# Altium schematic sheet DRS4_ADC.SchDoc: My title
size A3; Organization: University of California; Address1: 475 Portola Plaza; Address2: Los Angeles, CA 90095; DocumentNumber: 22; Revision: R01; SheetNumber: 22; SheetTotal: 35
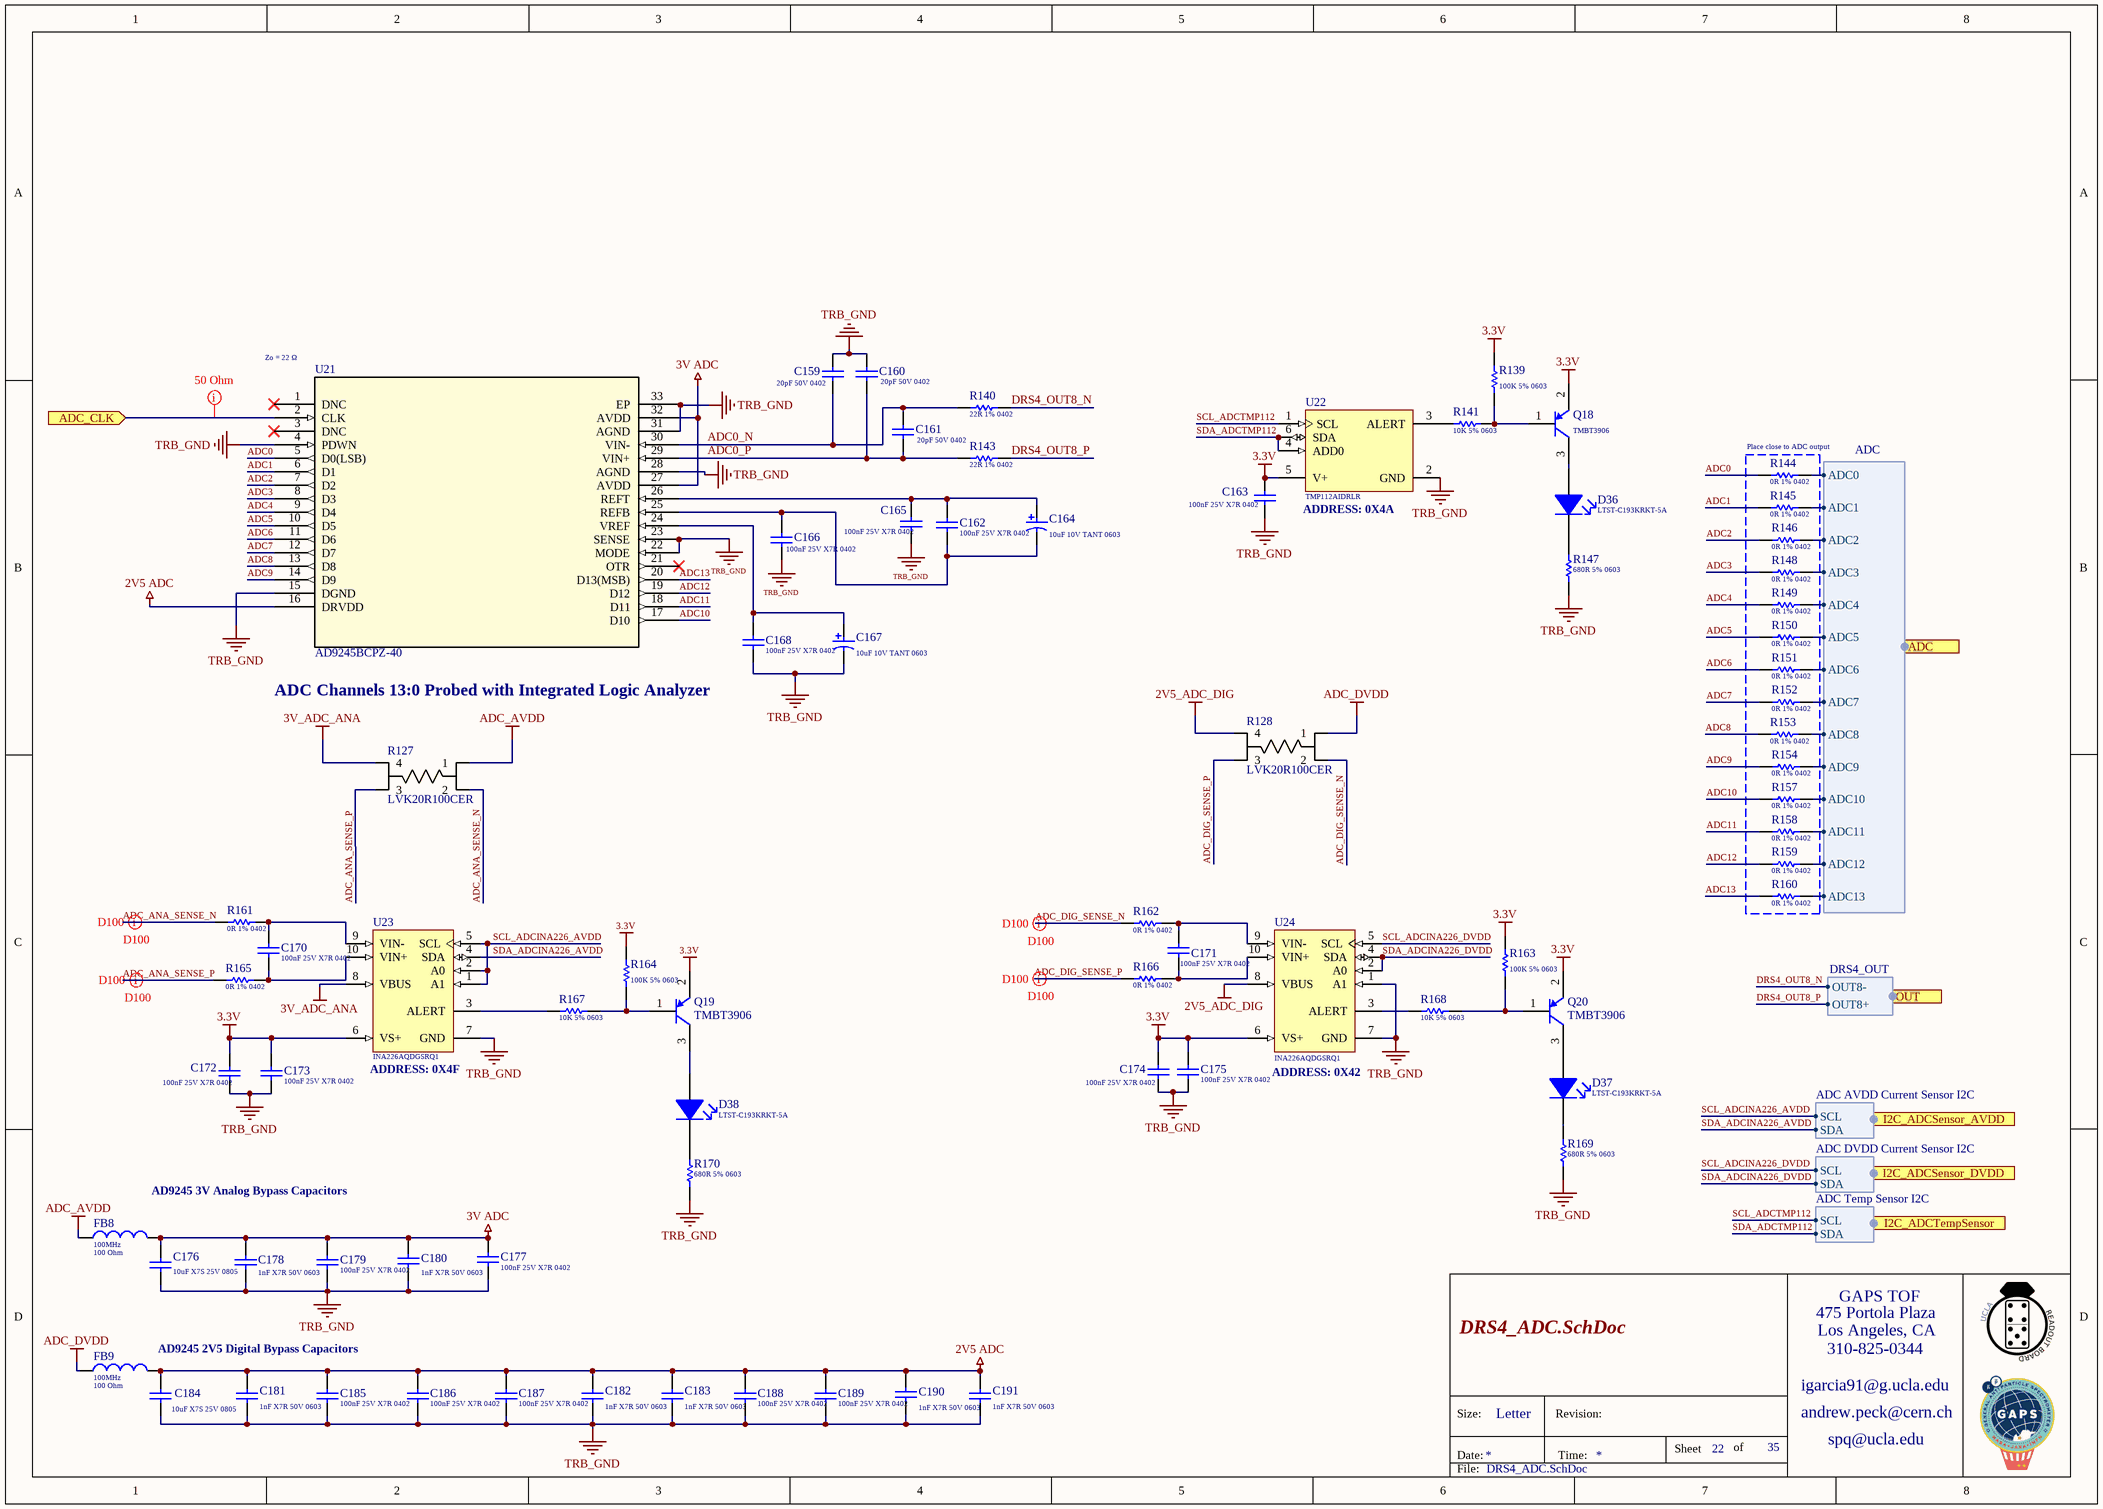
[diagram p0: DRS4_ADC.SchDoc]

## Parts
C159  Capacitance: 20pF 50V 0402  [Cap_Murata_GJM1555C1H200GB01D_20pF]  (hidden comment: Cap_Murata_GJM1555C1H200GB01D_20pF)
C160  Capacitance: 20pF 50V 0402  [Cap_Murata_GJM1555C1H200GB01D_20pF]  (hidden comment: Cap_Murata_GJM1555C1H200GB01D_20pF)
C161  Capacitance: 20pF 50V 0402  [Cap_Murata_GJM1555C1H200GB01D_20pF]  (hidden comment: Cap_Murata_GJM1555C1H200GB01D_20pF)
C162  Capacitance: 100nF 25V X7R 0402  [Cap_Taiyo_Yuden_TMK105B7104KV-FR_100nF]  (hidden comment: Cap_Taiyo_Yuden_TMK105B7104KV-FR_100nF)
C163  Capacitance: 100nF 25V X7R 0402  [Cap_Taiyo_Yuden_TMK105B7104KV-FR_100nF]  (hidden comment: Cap_Taiyo_Yuden_TMK105B7104KV-FR_100nF)
C164  10uF 10V TANT 0603  [VISH-TR8-M_L]
C165  Capacitance: 100nF 25V X7R 0402  [Cap_Taiyo_Yuden_TMK105B7104KV-FR_100nF]  (hidden comment: Cap_Taiyo_Yuden_TMK105B7104KV-FR_100nF)
C166  Capacitance: 100nF 25V X7R 0402  [Cap_Taiyo_Yuden_TMK105B7104KV-FR_100nF]  (hidden comment: Cap_Taiyo_Yuden_TMK105B7104KV-FR_100nF)
C167  10uF 10V TANT 0603  [VISH-TR8-M_L]
C168  Capacitance: 100nF 25V X7R 0402  [Cap_Taiyo_Yuden_TMK105B7104KV-FR_100nF]  (hidden comment: Cap_Taiyo_Yuden_TMK105B7104KV-FR_100nF)
C170  Capacitance: 100nF 25V X7R 0402  [Cap_Taiyo_Yuden_TMK105B7104KV-FR_100nF]  (hidden comment: Cap_Taiyo_Yuden_TMK105B7104KV-FR_100nF)
C171  Capacitance: 100nF 25V X7R 0402  [Cap_Taiyo_Yuden_TMK105B7104KV-FR_100nF]  (hidden comment: Cap_Taiyo_Yuden_TMK105B7104KV-FR_100nF)
C172  Capacitance: 100nF 25V X7R 0402  [Cap_Taiyo_Yuden_TMK105B7104KV-FR_100nF]  (hidden comment: Cap_Taiyo_Yuden_TMK105B7104KV-FR_100nF)
C173  Capacitance: 100nF 25V X7R 0402  [Cap_Taiyo_Yuden_TMK105B7104KV-FR_100nF]  (hidden comment: Cap_Taiyo_Yuden_TMK105B7104KV-FR_100nF)
C174  Capacitance: 100nF 25V X7R 0402  [Cap_Taiyo_Yuden_TMK105B7104KV-FR_100nF]  (hidden comment: Cap_Taiyo_Yuden_TMK105B7104KV-FR_100nF)
C175  Capacitance: 100nF 25V X7R 0402  [Cap_Taiyo_Yuden_TMK105B7104KV-FR_100nF]  (hidden comment: Cap_Taiyo_Yuden_TMK105B7104KV-FR_100nF)
C176  Capacitance: 10uF X7S 25V 0805  [Cap_Murata_ GRM21BC71E106ME11L_10uF]  (hidden comment: Cap_Murata_ GRM21BC71E106ME11L_10uF)
C177  Capacitance: 100nF 25V X7R 0402  [Cap_Taiyo_Yuden_TMK105B7104KV-FR_100nF]  (hidden comment: Cap_Taiyo_Yuden_TMK105B7104KV-FR_100nF)
C178  Capacitance: 1nF X7R 50V 0603  [Cap_Kemet_C0603C102J5RACAUTO_1nF]  (hidden comment: Cap_Kemet_C0603C102J5RACAUTO_1nF)
C179  Capacitance: 100nF 25V X7R 0402  [Cap_Taiyo_Yuden_TMK105B7104KV-FR_100nF]  (hidden comment: Cap_Taiyo_Yuden_TMK105B7104KV-FR_100nF)
C180  Capacitance: 1nF X7R 50V 0603  [Cap_Kemet_C0603C102J5RACAUTO_1nF]  (hidden comment: Cap_Kemet_C0603C102J5RACAUTO_1nF)
C181  Capacitance: 1nF X7R 50V 0603  [Cap_Kemet_C0603C102J5RACAUTO_1nF]  (hidden comment: Cap_Kemet_C0603C102J5RACAUTO_1nF)
C182  Capacitance: 1nF X7R 50V 0603  [Cap_Kemet_C0603C102J5RACAUTO_1nF]  (hidden comment: Cap_Kemet_C0603C102J5RACAUTO_1nF)
C183  Capacitance: 1nF X7R 50V 0603  [Cap_Kemet_C0603C102J5RACAUTO_1nF]  (hidden comment: Cap_Kemet_C0603C102J5RACAUTO_1nF)
C184  Capacitance: 10uF X7S 25V 0805  [Cap_Murata_ GRM21BC71E106ME11L_10uF]  (hidden comment: Cap_Murata_ GRM21BC71E106ME11L_10uF)
C185  Capacitance: 100nF 25V X7R 0402  [Cap_Taiyo_Yuden_TMK105B7104KV-FR_100nF]  (hidden comment: Cap_Taiyo_Yuden_TMK105B7104KV-FR_100nF)
C186  Capacitance: 100nF 25V X7R 0402  [Cap_Taiyo_Yuden_TMK105B7104KV-FR_100nF]  (hidden comment: Cap_Taiyo_Yuden_TMK105B7104KV-FR_100nF)
C187  Capacitance: 100nF 25V X7R 0402  [Cap_Taiyo_Yuden_TMK105B7104KV-FR_100nF]  (hidden comment: Cap_Taiyo_Yuden_TMK105B7104KV-FR_100nF)
C188  Capacitance: 100nF 25V X7R 0402  [Cap_Taiyo_Yuden_TMK105B7104KV-FR_100nF]  (hidden comment: Cap_Taiyo_Yuden_TMK105B7104KV-FR_100nF)
C189  Capacitance: 100nF 25V X7R 0402  [Cap_Taiyo_Yuden_TMK105B7104KV-FR_100nF]  (hidden comment: Cap_Taiyo_Yuden_TMK105B7104KV-FR_100nF)
C190  Capacitance: 1nF X7R 50V 0603  [Cap_Kemet_C0603C102J5RACAUTO_1nF]  (hidden comment: Cap_Kemet_C0603C102J5RACAUTO_1nF)
C191  Capacitance: 1nF X7R 50V 0603  [Cap_Kemet_C0603C102J5RACAUTO_1nF]  (hidden comment: Cap_Kemet_C0603C102J5RACAUTO_1nF)
D36  LTST-C193KRKT-5A  [Led_Lite-On_LTST-C193KGKT-5A_Red]
D37  LTST-C193KRKT-5A  [Led_Lite-On_LTST-C193KGKT-5A_Red]
D38  LTST-C193KRKT-5A  [Led_Lite-On_LTST-C193KGKT-5A_Red]
FB8  Measuring Frequency: 100MHz  Impedance: 100 Ohm  [FB_Wurth_Electronics_742792731_100Ohms]  (hidden comment: 742792731)
FB9  Measuring Frequency: 100MHz  Impedance: 100 Ohm  [FB_Wurth_Electronics_742792731_100Ohms]  (hidden comment: 742792731)
Q18  Series: TMBT3906  [BJT_PNP_Toshiba_TMBT3906]  (hidden comment: BJT_PNP_Toshiba_TMBT3906)
Q19  Series: TMBT3906  [BJT_PNP_Toshiba_TMBT3906]  (hidden comment: BJT_PNP_Toshiba_TMBT3906)
Q20  Series: TMBT3906  [BJT_PNP_Toshiba_TMBT3906]  (hidden comment: BJT_PNP_Toshiba_TMBT3906)
R127  LVK20R100CER  [OH_LVK20_OHM]
R128  LVK20R100CER  [OH_LVK20_OHM]
R139  100K 5% 0603  [RESC0603(1608)_N]
R140  22R 1% 0402  [RESC0402(1005)_L]
R141  10K 5% 0603  [RESC0603(1608)_L]
R143  22R 1% 0402  [RESC0402(1005)_L]
R144  Resistance: 0R 1% 0402  [Res_Vishay_CRCW04020000Z0EDC_0_Ohm]  (hidden comment: Res_Vishay_CRCW04020000Z0EDC_0_Ohm)
R145  Resistance: 0R 1% 0402  [Res_Vishay_CRCW04020000Z0EDC_0_Ohm]  (hidden comment: Res_Vishay_CRCW04020000Z0EDC_0_Ohm)
R146  Resistance: 0R 1% 0402  [Res_Vishay_CRCW04020000Z0EDC_0_Ohm]  (hidden comment: Res_Vishay_CRCW04020000Z0EDC_0_Ohm)
R147  680R 5% 0603  [RESC0603(1608)_L]
R148  Resistance: 0R 1% 0402  [Res_Vishay_CRCW04020000Z0EDC_0_Ohm]  (hidden comment: Res_Vishay_CRCW04020000Z0EDC_0_Ohm)
R149  Resistance: 0R 1% 0402  [Res_Vishay_CRCW04020000Z0EDC_0_Ohm]  (hidden comment: Res_Vishay_CRCW04020000Z0EDC_0_Ohm)
R150  Resistance: 0R 1% 0402  [Res_Vishay_CRCW04020000Z0EDC_0_Ohm]  (hidden comment: Res_Vishay_CRCW04020000Z0EDC_0_Ohm)
R151  Resistance: 0R 1% 0402  [Res_Vishay_CRCW04020000Z0EDC_0_Ohm]  (hidden comment: Res_Vishay_CRCW04020000Z0EDC_0_Ohm)
R152  Resistance: 0R 1% 0402  [Res_Vishay_CRCW04020000Z0EDC_0_Ohm]  (hidden comment: Res_Vishay_CRCW04020000Z0EDC_0_Ohm)
R153  Resistance: 0R 1% 0402  [Res_Vishay_CRCW04020000Z0EDC_0_Ohm]  (hidden comment: Res_Vishay_CRCW04020000Z0EDC_0_Ohm)
R154  Resistance: 0R 1% 0402  [Res_Vishay_CRCW04020000Z0EDC_0_Ohm]  (hidden comment: Res_Vishay_CRCW04020000Z0EDC_0_Ohm)
R157  Resistance: 0R 1% 0402  [Res_Vishay_CRCW04020000Z0EDC_0_Ohm]  (hidden comment: Res_Vishay_CRCW04020000Z0EDC_0_Ohm)
R158  Resistance: 0R 1% 0402  [Res_Vishay_CRCW04020000Z0EDC_0_Ohm]  (hidden comment: Res_Vishay_CRCW04020000Z0EDC_0_Ohm)
R159  Resistance: 0R 1% 0402  [Res_Vishay_CRCW04020000Z0EDC_0_Ohm]  (hidden comment: Res_Vishay_CRCW04020000Z0EDC_0_Ohm)
R160  Resistance: 0R 1% 0402  [Res_Vishay_CRCW04020000Z0EDC_0_Ohm]  (hidden comment: Res_Vishay_CRCW04020000Z0EDC_0_Ohm)
R161  Resistance: 0R 1% 0402  [Res_Vishay_CRCW04020000Z0EDC_0_Ohm]  (hidden comment: Res_Vishay_CRCW04020000Z0EDC_0_Ohm)
R162  Resistance: 0R 1% 0402  [Res_Vishay_CRCW04020000Z0EDC_0_Ohm]  (hidden comment: Res_Vishay_CRCW04020000Z0EDC_0_Ohm)
R163  100K 5% 0603  [RESC0603(1608)_N]
R164  100K 5% 0603  [RESC0603(1608)_N]
R165  Resistance: 0R 1% 0402  [Res_Vishay_CRCW04020000Z0EDC_0_Ohm]  (hidden comment: Res_Vishay_CRCW04020000Z0EDC_0_Ohm)
R166  Resistance: 0R 1% 0402  [Res_Vishay_CRCW04020000Z0EDC_0_Ohm]  (hidden comment: Res_Vishay_CRCW04020000Z0EDC_0_Ohm)
R167  10K 5% 0603  [RESC0603(1608)_L]
R168  10K 5% 0603  [RESC0603(1608)_L]
R169  680R 5% 0603  [RESC0603(1608)_L]
R170  680R 5% 0603  [RESC0603(1608)_L]
U21  AD9245  [CP_32_2]  (value not drawn)
U22  TMP112AIDRLR  [TMP112AIDRLR]
U23  INA226AQDGSRQ1  [INA226AQDGSRQ1]
U24  INA226AQDGSRQ1  [INA226AQDGSRQ1]

## Blocks framed on the sheet
Place close to ADC output: R144-R146 R148-R154 R157-R160

## Ports
ADC (harness ADC), ADC_CLK (in), I2C_ADCSensor_AVDD (harness ADC AVDD Current Sensor I2C), I2C_ADCSensor_DVDD (harness ADC DVDD Current Sensor I2C), I2C_ADCTempSensor (harness ADC Temp Sensor I2C), OUT (harness DRS4_OUT)

## Harnesses
ADC: ADC0, ADC1, ADC2, ADC3, ADC4, ADC5, ADC6, ADC7, ADC8, ADC9, ADC10, ADC11, ADC12, ADC13
DRS4_OUT: OUT8+, OUT8-
ADC AVDD Current Sensor I2C: SCL, SDA
ADC Temp Sensor I2C: SCL, SDA
ADC DVDD Current Sensor I2C: SCL, SDA

## Nets
2V5 ADC: C181.2 C182.2 C183.2 C184.1 C185.1 C186.1 C187.1 C188.1 C189.1 C190.2 C191.2 FB9.2 U21.16(DRVDD)
2V5_ADC_DIG: R128.4 U24.8(VBUS)
3.3V: C163.1 C172.2 C173.2 C174.2 C175.2 Q18.2(E) Q19.2(E) Q20.2(E) R139.2 R163.2 R164.2 U22.5(V+) U23.6(VS+) U24.6(VS+)
3V ADC: C176.1 C177.1 C178.2 C179.1 C180.2 FB8.2 U21.27(AVDD) U21.32(AVDD)
3V_ADC_ANA: R127.4 U23.8(VBUS)
ADC_AVDD: FB8.1 R127.1
ADC_DVDD: FB9.1 R128.1
TRB_GND: C159.2 C160.2 C163.2 C165.2 C166.2 C167.2 C168.2 C172.1 C173.1 C174.1 C175.1 C176.2 C177.2 C178.1 C179.2 C180.1 C181.1 C182.1 C183.1 C184.2 C185.2 C186.2 C187.2 C188.2 C189.2 C190.1 C191.1 R147.1 R169.1 R170.1 U21.4(PDWN) U21.15(DGND) U21.22(MODE) U21.23(SENSE) U21.28(AGND) U21.31(AGND) U21.33(EP) U22.2(GND) U23.7(GND) U24.1(A1) U24.7(GND)
ADC0: R144.1 U21.5(D0(LSB))
ADC0_N: C159.1 C161.2 R140.2 U21.30(VIN-)
ADC0_P: C160.1 C161.1 R143.2 U21.29(VIN+)
ADC1: R145.1 U21.6(D1)
ADC2: R146.1 U21.7(D2)
ADC3: R148.1 U21.8(D3)
ADC4: R149.1 U21.9(D4)
ADC5: R150.1 U21.10(D5)
ADC6: R151.1 U21.11(D6)
ADC7: R152.1 U21.12(D7)
ADC8: R153.1 U21.13(D8)
ADC9: R154.1 U21.14(D9)
ADC10: R157.1 U21.17(D10)
ADC11: R158.1 U21.18(D11)
ADC12: R159.1 U21.19(D12)
ADC13: R160.1 U21.20(D13(MSB))
ADC_ANA_SENSE_N: R127.2 R161.1
ADC_ANA_SENSE_P: R127.3 R165.1
ADC_CLK: U21.2(CLK) ; port ADC_CLK
ADC_DIG_SENSE_N: R128.2 R162.1
ADC_DIG_SENSE_P: R128.3 R166.1
DRS4_OUT8_N: R140.1 ; port OUT.OUT8-
DRS4_OUT8_P: R143.1 ; port OUT.OUT8+
SCL_ADCINA226_AVDD: U23.1(A1) U23.2(A0) U23.5(SCL) ; port I2C_ADCSensor_AVDD.SCL
SCL_ADCINA226_DVDD: U24.5(SCL) ; port I2C_ADCSensor_DVDD.SCL
SCL_ADCTMP112: U22.1(SCL) ; port I2C_ADCTempSensor.SCL
SDA_ADCINA226_AVDD: U23.4(SDA) ; port I2C_ADCSensor_AVDD.SDA
SDA_ADCINA226_DVDD: U24.2(A0) U24.4(SDA) ; port I2C_ADCSensor_DVDD.SDA
SDA_ADCTMP112: U22.4(ADD0) U22.6(SDA) ; port I2C_ADCTempSensor.SDA
NetC162_1: C162.1 C164.2 C166.1 U21.25(REFB)
NetC162_2: C162.2 C164.1 C165.1 U21.26(REFT)
NetC167_1: C167.1 C168.1 U21.24(VREF)
NetC170_1: C170.1 R165.2 U23.10(VIN+)
NetC170_2: C170.2 R161.2 U23.9(VIN-)
NetC171_1: C171.1 R166.2 U24.10(VIN+)
NetC171_2: C171.2 R162.2 U24.9(VIN-)
NetD36_1: D36.1(K) R147.2
NetD36_2: D36.2(A) Q18.3(C)
NetD37_1: D37.1(K) R169.2
NetD37_2: D37.2(A) Q20.3(C)
NetD38_1: D38.1(K) R170.2
NetD38_2: D38.2(A) Q19.3(C)
NetQ18_1: Q18.1(B) R139.1 R141.1
NetQ19_1: Q19.1(B) R164.1 R167.1
NetQ20_1: Q20.1(B) R163.1 R168.1
NetR141_2: R141.2 U22.3(ALERT)
NetR144_2: R144.2 ; port ADC.ADC0
NetR145_2: R145.2 ; port ADC.ADC1
NetR146_2: R146.2 ; port ADC.ADC2
NetR148_2: R148.2 ; port ADC.ADC3
NetR149_2: R149.2 ; port ADC.ADC4
NetR150_2: R150.2 ; port ADC.ADC5
NetR151_2: R151.2 ; port ADC.ADC6
NetR152_2: R152.2 ; port ADC.ADC7
NetR153_2: R153.2 ; port ADC.ADC8
NetR154_2: R154.2 ; port ADC.ADC9
NetR157_2: R157.2 ; port ADC.ADC10
NetR158_2: R158.2 ; port ADC.ADC11
NetR159_2: R159.2 ; port ADC.ADC12
NetR160_2: R160.2 ; port ADC.ADC13
NetR167_2: R167.2 U23.3(ALERT)
NetR168_2: R168.2 U24.3(ALERT)

Not connected (* = marked no-connect by the designer): U21 1(DNC)* 3(DNC)* 21(OTR)*

## Layout directives
net class S50: ADC_CLK
differential pair; differential pair class D100: ADC_ANA_SENSE_N, ADC_ANA_SENSE_P, ADC_DIG_SENSE_N, ADC_DIG_SENSE_P

## Notes on the sheet
- (near U21) Zo = 22 Ω
- ADDRESS: 0X4A
- (near C168) ADC Channels 13:0 Probed with Integrated Logic Analyzer
- D100
- (near U23) ADDRESS: 0X4F
- (near U24) ADDRESS: 0X42
- AD9245 3V Analog Bypass Capacitors
- (near FB9) AD9245 2V5 Digital Bypass Capacitors
- 475 Portola Plaza
- GAPS TOF
- igarcia91@g.ucla.edu
- Los Angeles, CA
- 310-825-0344
- Size:
- Date:
- Letter
- Revision:
- Time:
- Sheet
- of
- andrew.peck@cern.ch
- spq@ucla.edu
- File:

## Library data of the parts
C159-C161 = Cap_Murata_GJM1555C1H200GB01D_20pF: Multilayer Ceramic Capacitors MLCC - SMD/SMT 0402 20pF 50Volts C0G 2%; Supplier 1: Mouser; Supplier Part Number 1: 81-GJM1555C1H200GB01
C162 C163 C165 C166 C168 C170-C175 C177 C179 C185-C189 = Cap_Taiyo_Yuden_TMK105B7104KV-FR_100nF: CAP CER 100nF 25V X7R 0402; Supplier 1: Mouser; Supplier Part Number 1: 963-TMK105B7104KV-FR
C164 C167 = CMP-2000-07316-1: Tantalum Capacitor, 10 uF, +/- 20%, 10 V, -55 to 125 degC, 2-Pin SMD (M), RoHS, Tape and Reel; Manufacturer: Vishay; Manufacturer Part Number: TR8M106M010C2000; Capacitance: 10µF; Featured Product: TR8SeriesMoldedMicroTan™TantalumChipCapacitors; ESR (Equivalent Series Resistance): 2Ohm; Other Names: 718-1673-6; Catalog Drawings: TR8SeriesTR8SeriesBottom; Online Catalog: MICROTAN®TR8Series; Type: Molded; Mounting Technology: SurfaceMount; Category: Capacitors; Lifetime @ Temp.: -; Package Reference: TR8-M; Size / Dimension: 0.063"Lx0.033"W(1.60mmx0.85mm); Operating Temperature: -55°C~125°C; Mounting Type: SurfaceMount; Lead Spacing: -; Tolerance: ±20%; Standard Package: 1; Datasheet URL: http://www.vishay.com/docs/40114/tr8.pdf; Package Description: 2-Pin Surface Mount Device, Body 1.6 x 0.85 mm; Height - Seated (Max): 0.035"(0.89mm); Family: TantalumCapacitors; Manufacturer Size Code: M; Voltage - Rated: 10V; Series: MICROTAN®TR8; Packaging: Digi-Reel®; Manufacturer URL: http://www.vishay.com/; Datasheet Version: 03/2016; Package / Case: 0603(1608Metric); Features: GeneralPurpose
C176 C184 = Cap_Murata_ GRM21BC71E106ME11L_10uF: CAP CER 10uF 25V X7R 0805; Supplier 1: Mouser; Supplier Part Number 1: 81-GRM21BC71E106ME1L
C178 C180-C183 C190 C191 = Cap_Kemet_C0603C102J5RACAUTO_1nF: CAP CER 1nF 50V X7R 0603; Supplier 1: Mouser; Supplier Part Number 1: 80-C0603C102J5RAUTO
D36-D38 = Led_Lite-On_LTST-C193KGKT-5A_Red: Standard LEDs - SMD Red 470nm 28mcd 20mA; Supplier 1: Mouser; Supplier Part Number 1: 859-LTSTC193KRKT5A; Series: LTST-C193KRKT-5A
FB8 FB9 = FB_Wurth_Electronics_742792731_100Ohms: FB SMD 100 OHM 25% 1.2A 0402; DC Resistance: 90mOhm; Supplier 1: Mouser; Supplier Part Number 1: 710-742792731
Q18-Q20 = BJT_PNP_Toshiba_TMBT3906: Bipolar Transistors - BJT Transistor for Low Freq. Amplification; Manufacturer Part Number 1: TMBT3906,LM; Supplier 1: Mouser; Supplier Part Number 1: 757-TMBT3906LM; Manufacturer: Toshiba
R127 R128 = LVK20R100CER: Current Sense Resistors - SMD .1 OHM.25% 3/4W; Vendor: Ohmite; Built_By: EMA_UL_Team; SourceLibrary: Ohmite_2014-12-31; Manufacturer_Part_Number: LVK20R100CER; Copyright: Copyright (C) 2018 Accelerated Designs. All rights reserved; RefDes: RefDes; Type: DEV
R139 R163 R164 = CMP-1012-00122-1: 100K 0.1W 5% 0603 (1608 Metric)  SMD; Case-EIA: 0603; Value: 100000.00 Ohm; Case-Metric: 1608; Tolerance: 5 %; Power: 0.1 W; Technology: SMT
R140 R143 = CMP-1011-00320-1: 22R 0.063W 1% 0402 (1005 Metric)  SMD; Case-EIA: 0402; Case-Metric: 1005; Value: 22.00 Ohm; Tolerance: 1 %; Technology: SMT; Power: 0.063 W
R141 R167 R168 = CMP-1012-00098-1: 10K 0.1W 5% 0603 (1608 Metric)  SMD; Case-EIA: 0603; Value: 10000.00 Ohm; Case-Metric: 1608; Technology: SMT; Tolerance: 5 %; Power: 0.1 W
R144-R146 R148-R154 R157-R162 R165 R166 = Res_Vishay_CRCW04020000Z0EDC_0_Ohm: 0R 0.062W 1% 0402 (1005 Metric)  SMD; Supplier 1: Mouser; Supplier Part Number 1: 71-CRCW04020000Z0EDC
R147 R169 R170 = CMP-1012-00070-1: 680R 0.1W 5% 0603 (1608 Metric)  SMD; Case-EIA: 0603; Value: 680.00 Ohm; Case-Metric: 1608; Tolerance: 5 %; Technology: SMT; Power: 0.1 W
U21 = AD9245BCPZ-40: Analog to Digital Converters - ADC 14-Bit 40 MSPS 3V; Vendor: Analog Devices Inc; Built_By: EMA_UL_Team; C: Copyright (C) 2015 Accelerated Designs. All rights reserved; RefDes: RefDes; Type: DEV; Supplier 1: Mouser; Supplier Part Number 1: 584-AD9245BCPZ-40; Series: AD9245BCPZ-40; Part: AD9245BCPZ-40
U22 = TMP112AIDRLR: Board Mount Temperature Sensors Hi-Prec Lo-Pwr Dig Temp Sensor; Supplier 1: Mouser; Supplier Part Number 1: 595-TMP112AIDRLR
U23 U24 = INA226AQDGSRQ1: Current & Power Monitors & Regulators Automotive, 36-V, Ultra-High Accuracy, Low-/High-Side, I2C Out Current/Power Monitor w/ Alert 10-VSSOP -40 to 125; Supplier 1: Mouser; Supplier Part Number 1: 595-INA226AQDGSRQ1